# EAGLE design Muddi (EAGLE 8.0.0)
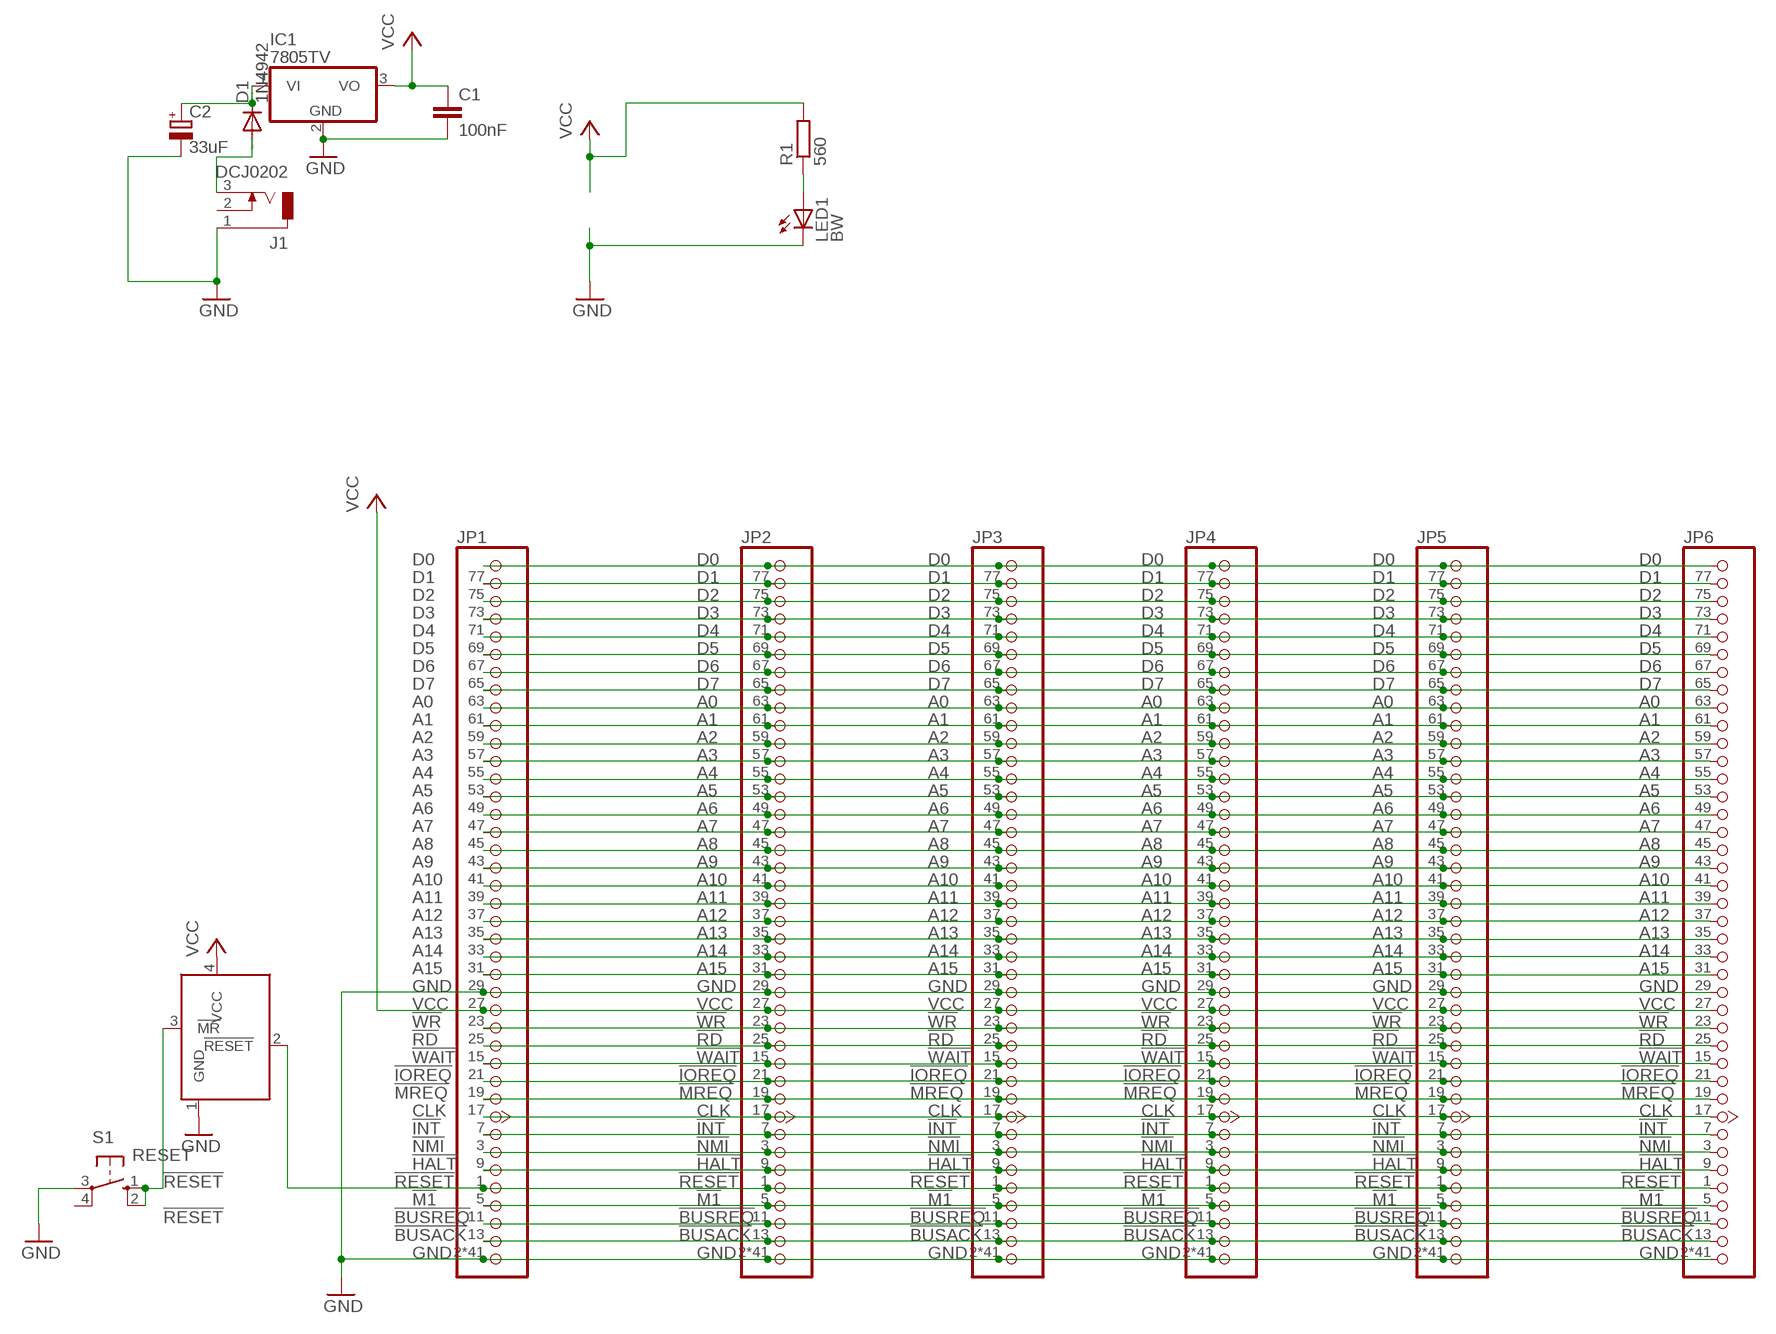
[diagram p0: schematic, sheet 1]

## Parts
C1  100nF  C2.5/2  [C2.5-2]
C2  33uF  CPOL-EUE2.5-7  [E2,5-7]
D1  1N4942  [DO41-10]
IC1  7805TV  [TO220V]
J1  DCJ0202  [DCJ0202]
JP1  JEANNECTOR_57102-F08-25  [57102-F08-25]
JP2  JEANNECTOR_57102-F08-25  [57102-F08-25]
JP3  JEANNECTOR_57102-F08-25  [57102-F08-25]
JP4  JEANNECTOR_57102-F08-25  [57102-F08-25]
JP5  JEANNECTOR_57102-F08-25  [57102-F08-25]
JP6  JEANNECTOR_57102-F08-25  [57102-F08-25]
LED1  BW  LED5MM  [LED5MM]
MAX811  MAX811  [SOT143]
R1  560  R-EU_0207/2V  [0207/2V]
S1  RESET  10-XX  [B3F-10XX]

## Nets
!BUSACK: JP1.13(!BUSACK) JP2.13(!BUSACK) JP3.13(!BUSACK) JP4.13(!BUSACK) JP5.13(!BUSACK) JP6.13(!BUSACK)
!BUSREQ: JP1.11(!BUSRQ) JP2.11(!BUSRQ) JP3.11(!BUSRQ) JP4.11(!BUSRQ) JP5.11(!BUSRQ) JP6.11(!BUSRQ)
!HALT: JP1.9(!HALT) JP2.9(!HALT) JP3.9(!HALT) JP4.9(!HALT) JP5.9(!HALT) JP6.9(!HALT)
!INT: JP1.7(!INT) JP2.7(!INT) JP3.7(!INT) JP4.7(!INT) JP5.7(!INT) JP6.7(!INT)
!IOREQ: JP1.21(!IOREQ) JP2.21(!IOREQ) JP3.21(!IOREQ) JP4.21(!IOREQ) JP5.21(!IOREQ) JP6.21(!IOREQ)
!M1: JP1.5(!M1) JP2.5(!M1) JP3.5(!M1) JP4.5(!M1) JP5.5(!M1) JP6.5(!M1)
!MREQ: JP1.19(!MREQ) JP2.19(!MREQ) JP3.19(!MREQ) JP4.19(!MREQ) JP5.19(!MREQ) JP6.19(!MREQ)
!NMI: JP1.3(!NMI) JP2.3(!NMI) JP3.3(!NMI) JP4.3(!NMI) JP5.3(!NMI) JP6.3(!NMI)
!RD: JP1.25(!RD) JP2.25(!RD) JP3.25(!RD) JP4.25(!RD) JP5.25(!RD) JP6.25(!RD)
!RESE: JP1.1(!RESET) JP2.1(!RESET) JP3.1(!RESET) JP4.1(!RESET) JP5.1(!RESET) JP6.1(!RESET) MAX811.2(!RESET)
!WAIT: JP1.15(!WAIT) JP2.15(!WAIT) JP3.15(!WAIT) JP4.15(!WAIT) JP5.15(!WAIT) JP6.15(!WAIT)
!WR: JP1.23(!WR) JP2.23(!WR) JP3.23(!WR) JP4.23(!WR) JP5.23(!WR) JP6.23(!WR)
A0: JP1.63(A0) JP2.63(A0) JP3.63(A0) JP4.63(A0) JP5.63(A0) JP6.63(A0)
A15: JP1.31(A15) JP2.31(A15) JP3.31(A15) JP4.31(A15) JP5.31(A15) JP6.31(A15)
CLK: JP1.17(CLK) JP2.17(CLK) JP3.17(CLK) JP4.17(CLK) JP5.17(CLK) JP6.17(CLK)
D0: JP1.79(D0) JP2.79(D0) JP3.79(D0) JP4.79(D0) JP5.79(D0) JP6.79(D0)
D7: JP1.65(D7) JP2.65(D7) JP3.65(D7) JP4.65(D7) JP5.65(D7) JP6.65(D7)
GND: C1.2 C2.- IC1.2(GND) J1.1 JP1.2(GND) JP1.4(GND) JP1.6(GND) JP1.8(GND) JP1.10(GND) JP1.12(GND) JP1.14(GND) JP1.16(GND) JP1.18(GND) JP1.20(GND) JP1.22(GND) JP1.24(GND) JP1.26(GND) JP1.28(GND) JP1.29(GND) JP1.30(GND) JP1.32(GND) JP1.34(GND) JP1.36(GND) JP1.38(GND) JP1.40(GND) JP1.42(GND) JP1.44(GND) JP1.46(GND) JP1.48(GND) JP1.50(GND) JP1.51(GND) JP1.52(GND) JP1.54(GND) JP1.56(GND) JP1.58(GND) JP1.60(GND) JP1.62(GND) JP1.64(GND) JP1.66(GND) JP1.68(GND) JP1.70(GND) JP1.72(GND) JP1.74(GND) JP1.76(GND) JP1.78(GND) JP1.80(GND) JP2.2(GND) JP2.4(GND) JP2.6(GND) JP2.8(GND) JP2.10(GND) JP2.12(GND) JP2.14(GND) JP2.16(GND) JP2.18(GND) JP2.20(GND) JP2.22(GND) JP2.24(GND) JP2.26(GND) JP2.28(GND) JP2.29(GND) JP2.30(GND) JP2.32(GND) JP2.34(GND) JP2.36(GND) JP2.38(GND) JP2.40(GND) JP2.42(GND) JP2.44(GND) JP2.46(GND) JP2.48(GND) JP2.50(GND) JP2.51(GND) JP2.52(GND) JP2.54(GND) JP2.56(GND) JP2.58(GND) JP2.60(GND) JP2.62(GND) JP2.64(GND) JP2.66(GND) JP2.68(GND) JP2.70(GND) JP2.72(GND) JP2.74(GND) JP2.76(GND) JP2.78(GND) JP2.80(GND) JP3.2(GND) JP3.4(GND) JP3.6(GND) JP3.8(GND) JP3.10(GND) JP3.12(GND) JP3.14(GND) JP3.16(GND) JP3.18(GND) JP3.20(GND) JP3.22(GND) JP3.24(GND) JP3.26(GND) JP3.28(GND) JP3.29(GND) JP3.30(GND) JP3.32(GND) JP3.34(GND) JP3.36(GND) JP3.38(GND) JP3.40(GND) JP3.42(GND) JP3.44(GND) JP3.46(GND) JP3.48(GND) JP3.50(GND) JP3.51(GND) JP3.52(GND) JP3.54(GND) JP3.56(GND) JP3.58(GND) JP3.60(GND) JP3.62(GND) JP3.64(GND) JP3.66(GND) JP3.68(GND) JP3.70(GND) JP3.72(GND) JP3.74(GND) JP3.76(GND) JP3.78(GND) JP3.80(GND) JP4.2(GND) JP4.4(GND) JP4.6(GND) JP4.8(GND) JP4.10(GND) JP4.12(GND) JP4.14(GND) JP4.16(GND) JP4.18(GND) JP4.20(GND) JP4.22(GND) JP4.24(GND) JP4.26(GND) JP4.28(GND) JP4.29(GND) JP4.30(GND) JP4.32(GND) JP4.34(GND) JP4.36(GND) JP4.38(GND) JP4.40(GND) JP4.42(GND) JP4.44(GND) JP4.46(GND) JP4.48(GND) JP4.50(GND) JP4.51(GND) JP4.52(GND) JP4.54(GND) JP4.56(GND) JP4.58(GND) JP4.60(GND) JP4.62(GND) JP4.64(GND) JP4.66(GND) JP4.68(GND) JP4.70(GND) JP4.72(GND) JP4.74(GND) JP4.76(GND) JP4.78(GND) JP4.80(GND) JP5.2(GND) JP5.4(GND) JP5.6(GND) JP5.8(GND) JP5.10(GND) JP5.12(GND) JP5.14(GND) JP5.16(GND) JP5.18(GND) JP5.20(GND) JP5.22(GND) JP5.24(GND) JP5.26(GND) JP5.28(GND) JP5.29(GND) JP5.30(GND) JP5.32(GND) JP5.34(GND) JP5.36(GND) JP5.38(GND) JP5.40(GND) JP5.42(GND) JP5.44(GND) JP5.46(GND) JP5.48(GND) JP5.50(GND) JP5.51(GND) JP5.52(GND) JP5.54(GND) JP5.56(GND) JP5.58(GND) JP5.60(GND) JP5.62(GND) JP5.64(GND) JP5.66(GND) JP5.68(GND) JP5.70(GND) JP5.72(GND) JP5.74(GND) JP5.76(GND) JP5.78(GND) JP5.80(GND) JP6.2(GND) JP6.4(GND) JP6.6(GND) JP6.8(GND) JP6.10(GND) JP6.12(GND) JP6.14(GND) JP6.16(GND) JP6.18(GND) JP6.20(GND) JP6.22(GND) JP6.24(GND) JP6.26(GND) JP6.28(GND) JP6.29(GND) JP6.30(GND) JP6.32(GND) JP6.34(GND) JP6.36(GND) JP6.38(GND) JP6.40(GND) JP6.42(GND) JP6.44(GND) JP6.46(GND) JP6.48(GND) JP6.50(GND) JP6.51(GND) JP6.52(GND) JP6.54(GND) JP6.56(GND) JP6.58(GND) JP6.60(GND) JP6.62(GND) JP6.64(GND) JP6.66(GND) JP6.68(GND) JP6.70(GND) JP6.72(GND) JP6.74(GND) JP6.76(GND) JP6.78(GND) JP6.80(GND) LED1.K(C) MAX811.1(GND) S1.3(P)
N$1: D1.A J1.3
N$2: JP1.77(D1) JP2.77(D1) JP3.77(D1) JP4.77(D1) JP5.77(D1) JP6.77(D1)
N$3: JP1.75(D2) JP2.75(D2) JP3.75(D2) JP4.75(D2) JP5.75(D2) JP6.75(D2)
N$4: JP1.73(D3) JP2.73(D3) JP3.73(D3) JP4.73(D3) JP5.73(D3) JP6.73(D3)
N$5: JP1.71(D4) JP2.71(D4) JP3.71(D4) JP4.71(D4) JP5.71(D4) JP6.71(D4)
N$6: JP1.69(D5) JP2.69(D5) JP3.69(D5) JP4.69(D5) JP5.69(D5) JP6.69(D5)
N$7: JP1.67(D6) JP2.67(D6) JP3.67(D6) JP4.67(D6) JP5.67(D6) JP6.67(D6)
N$10: JP1.61(A1) JP2.61(A1) JP3.61(A1) JP4.61(A1) JP5.61(A1) JP6.61(A1)
N$11: JP1.59(A2) JP2.59(A2) JP3.59(A2) JP4.59(A2) JP5.59(A2) JP6.59(A2)
N$12: JP1.57(A3) JP2.57(A3) JP3.57(A3) JP4.57(A3) JP5.57(A3) JP6.57(A3)
N$13: JP1.55(A4) JP2.55(A4) JP3.55(A4) JP4.55(A4) JP5.55(A4) JP6.55(A4)
N$14: JP1.53(A5) JP2.53(A5) JP3.53(A5) JP4.53(A5) JP5.53(A5) JP6.53(A5)
N$15: JP1.49(A6) JP2.49(A6) JP3.49(A6) JP4.49(A6) JP5.49(A6) JP6.49(A6)
N$16: JP1.47(A7) JP2.47(A7) JP3.47(A7) JP4.47(A7) JP5.47(A7) JP6.47(A7)
N$17: JP1.45(A8) JP2.45(A8) JP3.45(A8) JP4.45(A8) JP5.45(A8) JP6.45(A8)
N$18: JP1.43(A9) JP2.43(A9) JP3.43(A9) JP4.43(A9) JP5.43(A9) JP6.43(A9)
N$19: JP1.41(A10) JP2.41(A10) JP3.41(A10) JP4.41(A10) JP5.41(A10) JP6.41(A10)
N$20: JP1.39(A11) JP2.39(A11) JP3.39(A11) JP4.39(A11) JP5.39(A11) JP6.39(A11)
N$21: JP1.37(A12) JP2.37(A12) JP3.37(A12) JP4.37(A12) JP5.37(A12) JP6.37(A12)
N$22: JP1.35(A13) JP2.35(A13) JP3.35(A13) JP4.35(A13) JP5.35(A13) JP6.35(A13)
N$23: JP1.33(A14) JP2.33(A14) JP3.33(A14) JP4.33(A14) JP5.33(A14) JP6.33(A14)
N$25: LED1.A R1.1
N$26: C2.+ D1.C IC1.1(VI)
N$27: MAX811.3(!MR) S1.1(S) S1.2(S1)
VCC: C1.1 IC1.3(VO) JP1.27(VCC) JP2.27(VCC) JP3.27(VCC) JP4.27(VCC) JP5.27(VCC) JP6.27(VCC) MAX811.4(VCC) R1.2
Unconnected: J1.2 S1.4(P1)

## Library data of the parts
C1 = capacitor-wima:C: CAPACITOR naming: grid - package width
C2 = rcl:CPOL-EU: POLARIZED CAPACITOR, European symbol
D1 = diode:1N4942: DIODE 1.0 A, 200 V, 150 ns; MF: ON SEMICONDUCTOR; MPN: 1N4935G; OC_FARNELL: 1126305
IC1 = linear:78*: Positive VOLTAGE REGULATOR Source: http://cache.national.com/ds/LM/LM78L05.pdf http://www.fairchildsemi.com/ds/LM/LM7805.pdf
J1 = con-jack:DCJ0202: DC POWER JACK Source: DCJ0202.pdf; OC_FARNELL: unknown; OC_NEWARK: unknown
JP1-JP6 = jean:JEANNECTOR: PIN HEADER
LED1 = led:LED: LED OSRAM: - CHIPLED LG R971, LG N971, LY N971, LG Q971, LY Q971, LO R971, LY R971 LH N974, LH R974 LS Q976, LO Q976, LY Q976 LO Q996 - Hyper CHIPLED LW Q18S LB Q993, LB Q99A, LB R99A - SideLED LS A670, LO A670, LY A670, LG A670, LP A670 LB A673, LV A673, LT A673, LW A673 LH A674 LY A675 LS A676, LA A676, LO A676, LY A676, LW A676 LS A679, LY A679, LG A679 - Hyper Micro SIDELED® LS Y876, LA Y876, LO Y876, LY Y876 LT Y87S - SmartLED LW L88C, LW L88S LB L89C, LB L89S, LG L890 LS L89K, LO L89K, LY L89K LS L896, LA L896, LO L896, LY L896 - TOPLED LS T670, LO T670, LY T670, LG T670, LP T670 LSG T670, LSP T670, LSY T670, LOP T670, LYG T670 LG T671, LOG T671, LSG T671 LB T673, LV T673, LT T673, LW T673 LH T674 LS T676, LA T676, LO T676, LY T676, LB T676, LH T676, LSB T676, LW T676 LB T67C, LV T67C, LT T67C, LS T67K, LO T67K, LY T67K, LW E67C LS E67B, LA E67B, LO E67B, LY E67B, LB E67C, LV E67C, LT E67C LW T67C LS T679, LY T679, LG T679 LS T770, LO T770, LY T770, LG T770, LP T770 LB T773, LV T773, LT T773, LW T773 LH T774 LS E675, LA E675, LY E675, LS T675 LS T776, LA T776, LO T776, LY T776, LB T776 LHGB T686 LT T68C, LB T68C - Hyper Mini TOPLED® LB M676 - Mini TOPLED Santana® LG M470 LS M47K, LO M47K, LY M47K Source: http://www.osram.convergy.de LUXEON: - LUMILED® LXK2-PW12-R00, LXK2-PW12-S00, LXK2-PW14-U00, LXK2-PW14-V00 LXK2-PM12-R00, LXK2-PM12-S00, LXK2-PM14-U00 LXK2-PE12-Q00, LXK2-PE12-R00, LXK2-PE12-S00, LXK2-PE14-T00, LXK2-PE14-U00 LXK2-PB12-K00, LXK2-PB12-L00, LXK2-PB12-M00, LXK2-PB14-N00, LXK2-PB14-P00, LXK2-PB14-Q00 LXK2-PR12-L00, LXK2-PR12-M00, LXK2-PR14-Q00, LXK2-PR14-R00 LXK2-PD12-Q00, LXK2-PD12-R00, LXK2-PD12-S00 LXK2-PH12-R00, LXK2-PH12-S00 LXK2-PL12-P00, LXK2-PL12-Q00, LXK2-PL12-R00 Source: www.luxeon.com KINGBRIGHT: KA-3528ASYC Source: www.kingbright.com
MAX811 = jean:MAX811
R1 = resistor:R-EU_: RESISTOR, European symbol
S1 = switch-omron:10-XX: OMRON SWITCH; MF: OMRON ELECTRONIC COMPONENTS; MPN: B3F-1000; OC_FARNELL: 176432; OC_NEWARK: 36M3542

## Board
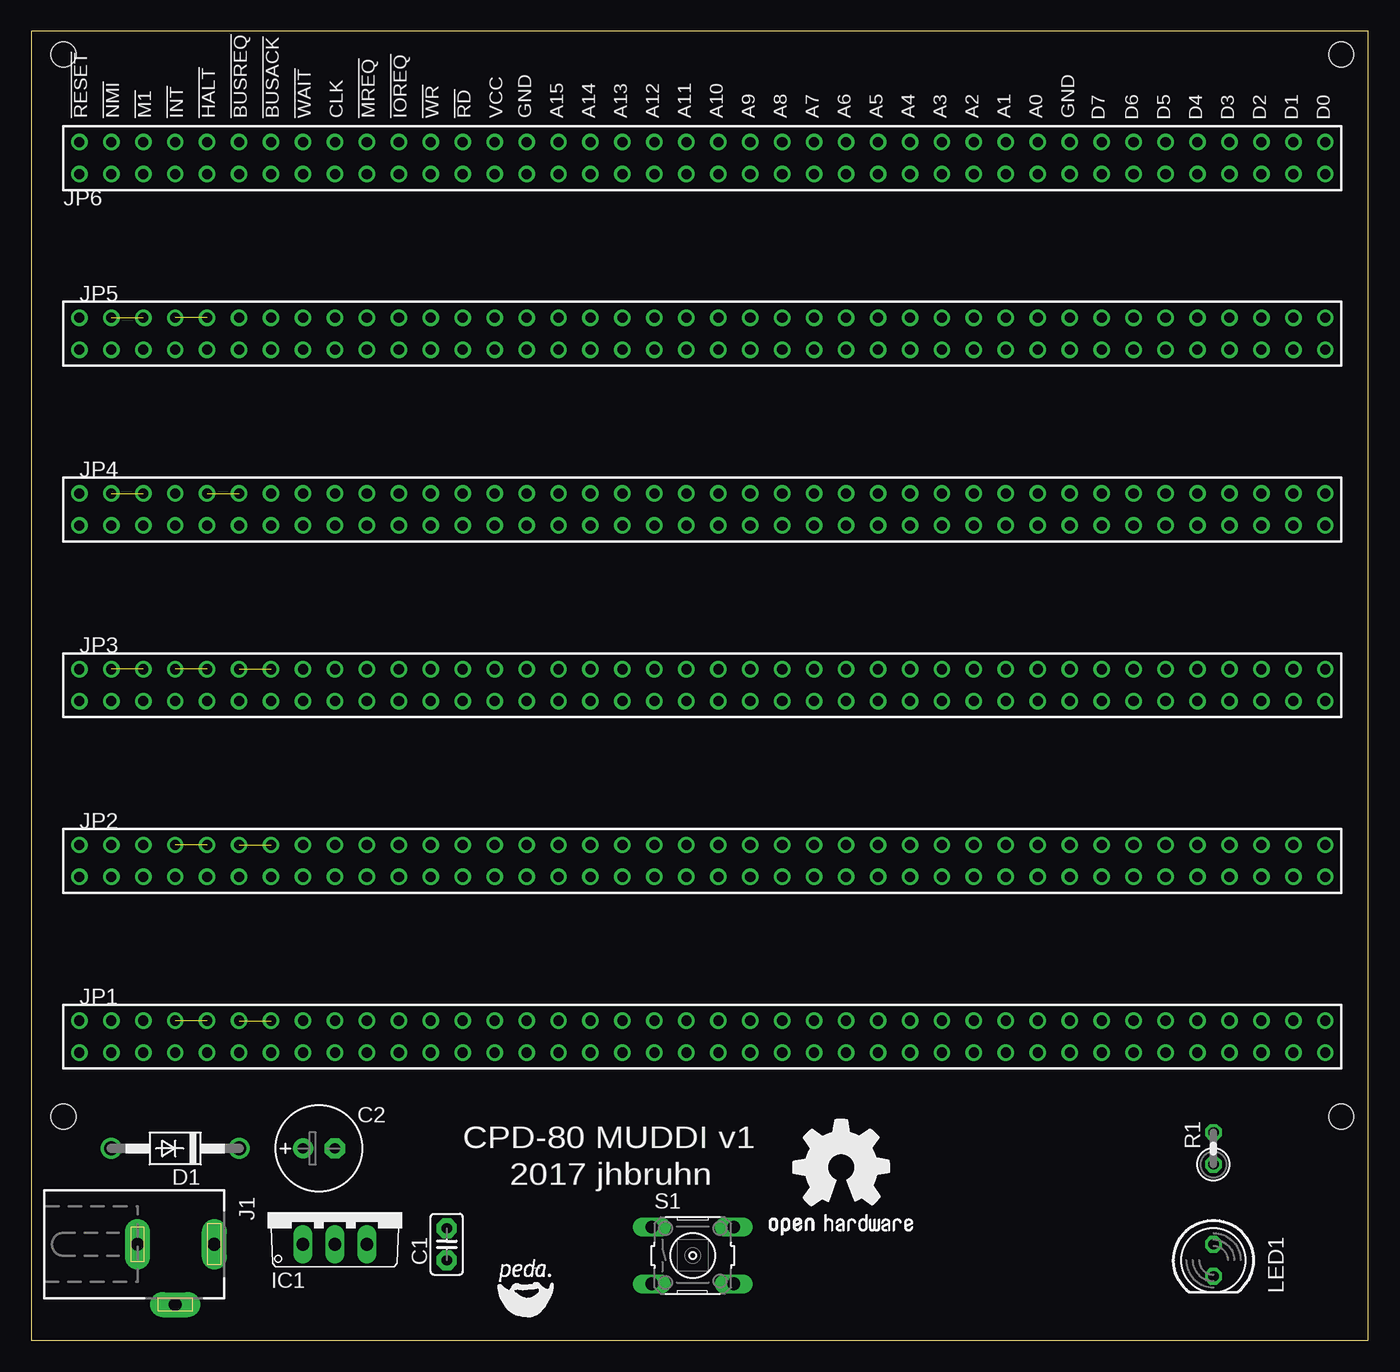
[diagram p1: board, top side]
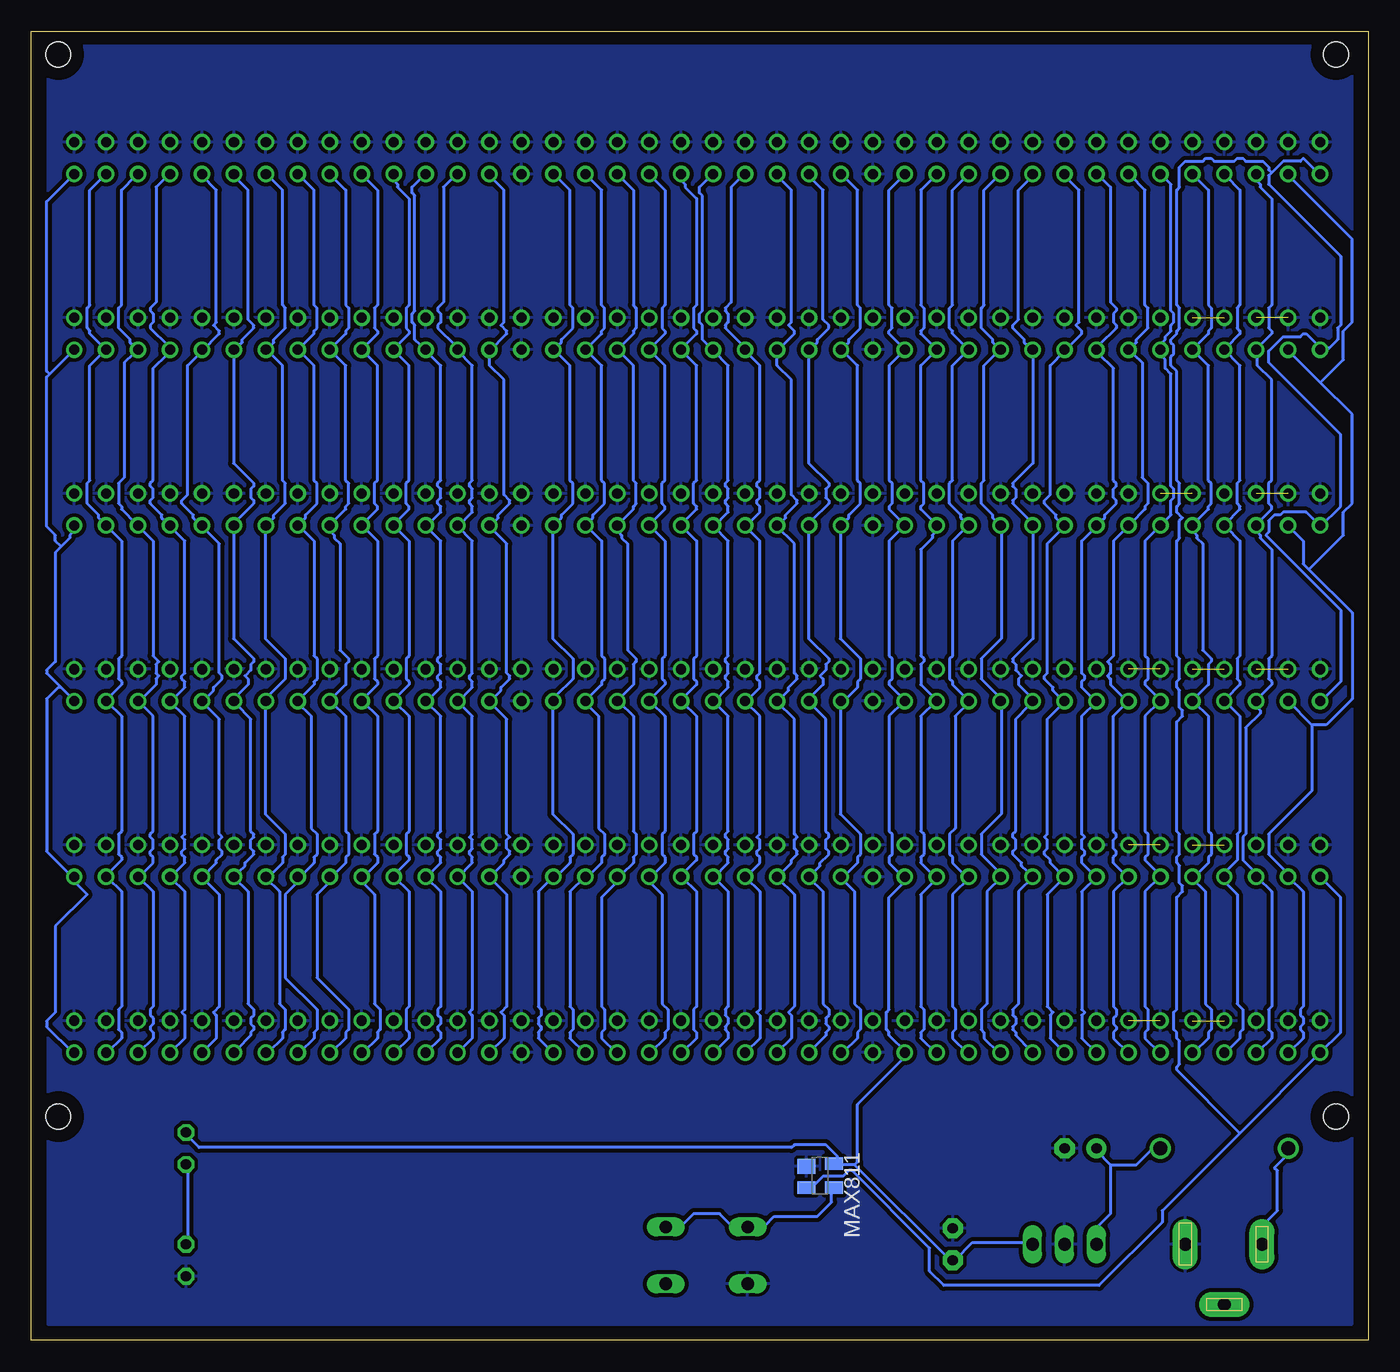
[diagram p2: board, bottom side, seen from below]

Size 106.27 x 104.05 mm. Coordinates in mm from the lower left corner, seen from the top.
Outline: 0,0 106.27,0 106.27,104.05 0,104.05 0,0
Copper layers (1*16): Top 0.035mm / dielectric 1.5mm / Bottom 0.035mm
Design rules "default": minimum track width 10mil, minimum drill 24mil, track to track 8mil, track to pad 8mil, pad to pad 8mil, via to via 8mil, smd to smd 8mil, copper to edge 40mil, drill to drill 8mil, minimum pad ring 10mil, minimum via ring 8mil, stop-mask expansion 4mil, vias tented up to drill 0mil, thermal gap 10mil
Holes 2 mm at 2.54,17.78 104.14,17.78 2.54,102.23 104.14,102.23

### Footprints (pad centres in the part's own frame; a part is rotated, then mirrored left to right if it is on the bottom)
C2.5-2 = drill 0.813 pad 1.6 octagon: 1 -1.27,0; 2 1.27,0
E2,5-7 = drill 0.813 pad 1.6: + -1.27,0 | drill 0.813 pad 1.6 octagon: - 1.27,0
DO41-10 = drill 1.118: A 5.08,0; C -5.08,0
TO220V = drill 1.016 long: 1 -2.54,-2.54; 2 0,-2.54; 3 2.54,-2.54
DCJ0202 = drill 1 pad 2 long: 1 0,3.1; 2 4.8,0; 3 0,-3
57102-F08-25 = drill 0.8 pad 1.143: 1 -8.89,-1.27; 2 -8.89,1.27; 3 -6.35,-1.27; 4 -6.35,1.27; 5 -3.81,-1.27; 6 -3.81,1.27; 7 -1.27,-1.27; 8 -1.27,1.27; 9 1.27,-1.27; 10 1.27,1.27; 11 3.81,-1.27; 12 3.81,1.27; 13 6.35,-1.27; 14 6.35,1.27; 15 8.89,-1.27; 16 8.89,1.27; 17 11.43,-1.27; 18 11.43,1.27; 19 13.97,-1.27; 20 13.97,1.27; 21 16.51,-1.27; 22 16.51,1.27; 23 19.05,-1.27; 24 19.05,1.27; 25 21.59,-1.27; 26 21.59,1.27; 27 24.13,-1.27; 28 24.13,1.27; 29 26.67,-1.27; 30 26.67,1.27; 31 29.21,-1.27; 32 29.21,1.27; 33 31.75,-1.27; 34 31.75,1.27; 35 34.29,-1.27; 36 34.29,1.27; 37 36.83,-1.27; 38 36.83,1.27; 39 39.37,-1.27; 40 39.37,1.27; 41 41.91,-1.27; 42 41.91,1.27; 43 44.45,-1.27; 44 44.45,1.27; 45 46.99,-1.27; 46 46.99,1.27; 47 49.53,-1.27; 48 49.53,1.27; 49 52.07,-1.27; 50 52.07,1.27; 51 54.61,-1.27; 52 54.61,1.27; 53 57.15,-1.27; 54 57.15,1.27; 55 59.69,-1.27; 56 59.69,1.27; 57 62.23,-1.27; 58 62.23,1.27; 59 64.77,-1.27; 60 64.77,1.27; 61 67.31,-1.27; 62 67.31,1.27; 63 69.85,-1.27; 64 69.85,1.27; 65 72.39,-1.27; 66 72.39,1.27; 67 74.93,-1.27; 68 74.93,1.27; 69 77.47,-1.27; 70 77.47,1.27; 71 80.01,-1.27; 72 80.01,1.27; 73 82.55,-1.27; 74 82.55,1.27; 75 85.09,-1.27; 76 85.09,1.27; 77 87.63,-1.27; 78 87.63,1.27; 79 90.17,-1.27; 80 90.17,1.27
LED5MM = drill 0.813 octagon: A -1.27,0; K 1.27,0
SOT143 = smd 1.2 x 1.44: 1 -0.75,-1.1 | smd 1 x 1.44: 2 0.95,-1.1; 3 0.95,1.1; 4 -0.95,1.1
0207/2V = drill 0.813 octagon: 1 -1.27,0; 2 1.27,0
B3F-10XX = drill 1.016 long: 1 -3.251,2.261; 2 3.251,2.261; 3 -3.251,-2.261; 4 3.251,-2.261

### Placement (x,y rotation side)
C1  33.02,7.62 90 top
C2  22.86,15.24 0 top
D1  11.43,15.24 180 top
IC1  24.13,10.16 0 top
J1  11.43,7.62 270 top
JP1  12.7,24.13 0 top
JP2  12.7,38.1 0 top
JP3  12.7,52.07 0 top
JP4  12.7,66.04 0 top
JP5  12.7,80.01 0 top
JP6  12.7,93.98 0 top
LED1  93.98,6.35 270 top
MAX811  43.56,13.08 270 bottom
R1  93.98,15.24 90 top
S1  52.58,6.73 0 top
U$1  [OSHW1]  58.01,6.6 0 top

### Tracks (layer width: path | path; a pad name or v marks a point on that pad's centre or on a via)
!BUSACK
  Bottom 0.254: 19.1,36.8 20.24,35.66 20.24,26.52 20.02,26.29 20.02,25.83 20.24,25.6 20.24,25.15 20.02,24.92 20.02,24.69 20.24,24.46 20.24,24 19.1,22.86 JP1.13 | 19.1,36.8 20.24,37.95 20.24,38.41 20.02,38.63 20.02,38.86 20.24,39.09 20.24,39.78 20.02,40.01 20.02,40.23 20.24,40.46 20.24,49.61 JP3.13 19.1,50.98 19.33,50.98 20.47,52.12 20.47,52.58 20.7,52.81 20.47,53.03 20.47,53.72 20.7,53.95 20.24,54.41 20.24,63.55 19.1,64.69 JP4.13 18.87,64.92 17.73,66.06 17.73,66.29 17.5,66.52 17.5,68.12 17.96,68.58 17.96,77.72 18.64,78.41 | 19.1,36.8 JP2.13 | 18.64,78.41 18.87,78.64 JP5.13 18.64,78.41 | 18.64,78.41 18.64,79.1 18.41,79.32 18.41,79.55 17.5,80.47 17.5,82.07 17.73,82.3 17.73,91.44 18.87,92.58 JP6.13
!BUSREQ
  Bottom 0.254: JP1.11 16.59,22.86 17.73,24 17.73,24.46 17.5,24.69 17.5,26.29 17.73,26.52 17.73,35.66 16.59,36.8 JP2.11 16.59,37.03 17.73,38.18 17.73,38.41 17.5,38.63 17.5,40.23 17.73,40.46 17.73,49.61 16.59,50.75 JP3.11 16.59,50.98 17.73,52.12 17.73,52.35 17.5,52.58 17.5,54.18 17.73,54.41 17.73,63.55 JP4.11 16.59,64.92 16.36,65.15 16.13,65.15 15.67,65.61 15.67,66.75 15.44,66.98 15.44,67.67 15.67,67.89 15.67,76.81 16.13,77.27 16.13,77.95 16.36,78.18 16.36,78.64 JP5.11 16.36,78.87 16.36,79.32 16.13,79.55 16.13,79.78 15.67,80.24 15.67,80.7 15.44,80.92 15.44,81.61 15.67,81.84 15.67,91.9 16.36,92.58 JP6.11
!HALT
  Bottom 0.254: JP6.9 12.7,91.44 12.7,82.3 12.47,82.07 12.47,80.47 12.7,80.24 12.7,80.01 JP5.9 13.84,78.64 12.7,77.5 12.7,68.35 12.47,68.12 12.47,66.52 12.7,66.29 12.7,66.06 13.84,64.92 JP4.9 13.84,64.69 13.84,64.24 13.61,64.01 13.61,63.78 13.16,63.32 13.16,54.86 12.47,54.18 12.47,53.95 12.7,53.72 12.7,52.12 13.84,50.98 JP3.9 13.84,50.75 12.7,49.61 12.7,40.46 12.47,40.23 12.47,38.63 12.7,38.41 12.7,37.95 13.61,37.03 13.84,37.03 JP2.9 14.07,36.8 12.93,35.66 12.93,26.75 12.47,26.29 12.47,24.69 12.7,24.46 12.7,24 13.84,22.86 JP1.9
!INT
  Bottom 0.254: JP6.7 11.33,92.58 10.18,91.44 10.18,82.3 10.41,82.07 10.41,80.47 10.18,80.24 10.18,80.01 11.33,78.87 JP5.7 10.18,77.5 10.18,68.35 10.41,68.12 10.41,66.52 10.18,66.29 10.18,66.06 11.33,64.92 JP4.7 11.33,64.69 10.18,63.55 10.18,54.41 10.41,54.18 10.41,52.58 10.18,52.35 10.18,52.12 11.33,50.98 JP3.7 11.33,50.75 10.18,49.61 10.18,40.46 10.41,40.23 10.41,38.18 11.33,37.26 11.33,37.03 JP2.7 11.33,36.8 11.33,36.35 10.41,35.43 10.41,26.75 9.96,26.29 9.96,24.69 10.18,24.46 10.18,24 11.33,22.86 JP1.7
!IOREQ
  Bottom 0.254: JP1.21 29.39,22.86 30.53,24 30.53,24.46 30.76,24.69 30.76,26.29 30.3,26.75 30.3,35.66 29.16,36.8 JP2.21 29.39,37.03 29.39,37.26 30.76,38.63 30.76,40.23 29.16,41.83 29.16,50.75 JP3.21 29.39,50.98 29.39,51.21 30.76,52.58 30.76,54.18 29.16,55.78 29.16,64.69 JP4.21 29.16,64.92 29.39,65.15 29.62,65.15 29.84,65.38 29.84,65.61 30.76,66.52 30.76,68.12 30.53,68.35 30.53,77.5 29.62,78.41 | 29.62,78.41 29.39,78.64 JP5.21 29.62,78.41 | 29.62,78.41 29.62,79.1 29.84,79.32 29.84,79.55 30.76,80.47 30.76,82.07 30.53,82.3 30.53,91.44 29.39,92.58 JP6.21
!M1
  Bottom 0.254: JP6.5 8.81,92.58 8.81,92.13 8.59,91.9 8.59,91.67 7.67,90.75 7.67,82.3 7.9,82.07 7.9,80.47 7.67,80.24 7.67,80.01 8.81,78.87 JP5.5 8.81,78.64 8.81,77.5 7.67,76.35 7.67,68.35 7.9,68.12 7.9,66.52 7.67,66.29 7.67,66.06 8.81,64.92 JP4.5 8.81,64.69 8.81,64.24 8.59,64.01 8.59,63.78 7.67,62.87 7.67,54.41 7.9,54.18 7.9,52.58 7.67,52.35 7.67,52.12 8.81,50.98 JP3.5 8.81,50.75 8.81,50.29 8.59,50.06 8.59,49.84 9.73,48.69 9.73,40.23 9.96,40.01 9.96,38.18 9.04,37.26 9.04,37.03 JP2.5 8.81,36.8 7.67,35.66 7.67,26.52 7.9,26.29 7.9,24.69 7.67,24.46 7.67,24 8.81,22.86 JP1.5
!MREQ
  Bottom 0.254: JP1.19 26.87,22.86 26.87,23.09 28.02,24.23 28.02,24.46 28.25,24.69 28.25,24.92 28.02,25.15 28.02,25.6 28.25,25.83 28.25,26.29 27.79,26.75 27.79,35.66 26.64,36.8 JP2.19 26.64,37.03 26.87,37.26 27.1,37.26 27.56,37.72 27.56,37.95 28.25,38.63 28.25,38.86 28.02,39.09 28.02,39.78 28.25,40.01 28.25,40.23 28.02,40.46 28.02,49.38 26.87,50.52 26.87,50.75 JP3.19 26.87,50.98 26.87,51.21 27.79,52.12 27.79,52.58 27.56,52.81 28.02,53.26 28.02,53.72 28.25,53.95 28.25,54.18 26.64,55.78 26.64,64.69 JP4.19 26.87,64.92 26.87,65.15 28.25,66.52 28.25,66.75 28.02,66.98 28.02,67.67 28.25,67.89 28.25,68.12 26.64,69.72 26.64,78.64 JP5.19 26.64,78.87 26.87,79.1 27.1,79.1 27.33,79.32 27.33,79.55 28.25,80.47 28.25,80.7 27.79,81.15 27.79,91.44 26.87,92.35 26.87,92.58 JP6.19
!NMI
  Bottom 0.254: JP1.3 6.3,22.86 5.16,24 5.16,24.46 5.38,24.69 5.38,24.92 5.16,25.15 5.16,25.6 5.38,25.83 5.38,26.29 5.16,26.52 5.16,35.66 6.3,36.8 JP2.3 6.53,37.03 6.53,37.26 7.9,38.63 7.9,40.23 4.47,43.66 4.47,48.92 | 4.47,48.92 JP3.3 | 4.47,48.92 3.33,48.92 1.27,50.98 1.27,57.84 4.7,61.27 | 4.7,61.27 5.16,61.72 5.16,63.55 6.3,64.69 JP4.3 | 3.79,76.12 1.27,73.61 1.27,66.52 1.96,65.84 1.96,64.01 4.7,61.27 | 3.79,76.12 6.3,78.64 JP5.3 | 3.79,76.12 1.96,77.95 1.96,80.24 1.27,80.92 1.27,87.55 6.3,92.58 JP6.3
!RD
  Bottom 0.254: JP6.25 35.56,91.44 35.56,82.3 35.33,82.07 35.33,80.47 35.56,80.24 35.56,80.01 JP5.25 34.42,78.64 35.56,77.5 35.56,68.35 35.33,68.12 35.33,66.52 35.56,66.29 35.56,66.06 34.42,64.92 JP4.25 34.42,64.69 34.42,64.24 34.65,64.01 34.65,63.78 35.56,62.87 35.56,54.41 35.33,54.18 35.33,53.95 35.56,53.72 35.56,52.12 34.42,50.98 JP3.25 34.42,50.75 35.56,49.61 35.56,40.46 35.33,40.23 35.33,38.63 35.56,38.41 35.56,37.95 34.65,37.03 34.42,37.03 JP2.25 34.19,36.8 35.56,35.43 35.56,26.52 35.33,26.29 35.33,24.69 35.56,24.46 35.56,24 34.42,22.86 JP1.25
!RESE
  Bottom 0.254: 7.67,92.81 6.76,93.73 5.38,93.73 5.16,93.95 4.24,93.04 4.01,93.04 3.79,92.81 JP6.1 | 7.67,92.81 7.9,92.58 7.9,91.9 2.18,86.18 2.18,80.7 2.41,80.47 2.41,79.55 3.1,78.87 3.79,78.87 JP5.1 4.01,78.87 4.01,79.1 4.93,80.01 5.16,80.01 5.38,79.78 6.76,79.78 7.9,78.64 7.9,77.72 2.18,72.01 2.18,66.29 3.79,64.69 JP4.1 3.79,64.92 4.01,65.15 4.24,65.15 4.93,65.84 6.76,65.84 6.98,65.61 7.44,65.61 7.9,65.15 7.9,64.24 8.13,64.01 2.18,58.06 2.18,52.35 3.56,50.98 3.79,50.98 JP3.1 | 3.79,22.86 10.18,16.46 | 10.18,16.46 16.36,10.29 16.36,9.37 21.39,4.34 33.73,4.34 34.87,5.49 34.87,7.32 41.05,13.49 41.28,13.49 41.73,13.03 43.33,13.03 44.02,12.34 44.48,12.34 MAX811.2 | JP2.1 2.18,35.2 2.18,24.46 3.79,22.86 | 3.79,22.86 JP1.1 | 7.67,92.81 7.9,93.04 7.9,93.27 8.36,93.73 9.73,93.73 9.96,93.95 10.41,93.95 10.64,93.73 12.24,93.73 12.47,93.95 12.93,93.95 13.16,93.73 14.53,93.73 14.99,93.27 14.99,91.67 15.21,91.44 15.21,82.3 14.99,82.07 14.99,80.47 15.21,80.24 15.21,80.01 15.67,79.55 15.67,79.32 15.44,79.1 15.44,78.41 15.67,78.18 15.67,77.5 15.21,77.04 15.21,68.35 14.99,68.12 14.99,66.52 15.21,66.29 15.21,65.84 14.76,65.38 14.99,65.15 14.99,63.78 15.21,63.55 15.21,54.41 14.99,54.18 14.99,52.58 15.21,52.35 15.21,51.89 14.99,51.66 14.99,50.29 14.76,50.06 14.76,49.61 15.21,49.15 15.21,40.46 14.99,40.23 14.99,38.63 15.21,38.41 15.21,37.95 14.99,37.72 14.99,36.35 14.76,36.12 14.76,35.66 15.21,35.2 15.21,26.29 15.44,26.06 15.44,24.69 15.21,24.46 15.21,24 14.99,23.77 14.99,21.95 15.21,21.72 15.21,21.49 10.18,16.46
!WAIT
  Bottom 0.254: JP6.15 21.39,92.81 21.16,92.58 21.16,92.35 20.47,91.67 20.47,82.53 20.02,82.07 20.02,81.84 20.24,81.61 20.24,80.92 20.02,80.7 20.02,80.47 21.39,79.1 21.39,78.87 JP5.15 21.39,78.64 21.39,78.41 20.24,77.27 20.24,68.35 20.02,68.12 20.02,67.89 20.24,67.67 20.24,66.98 20.02,66.75 20.02,66.52 20.93,65.61 20.93,65.38 21.16,65.15 21.39,65.15 21.61,64.92 JP4.15 21.61,64.69 22.76,63.55 22.76,53.03 22.53,52.81 22.53,52.58 22.76,52.35 22.76,51.89 21.61,50.75 | 21.61,36.8 22.76,35.66 22.76,26.29 22.53,26.06 22.76,25.83 22.76,24 21.61,22.86 JP1.15 | 21.61,50.75 22.76,49.61 22.76,40.23 22.53,40.01 22.76,39.78 22.76,39.09 22.53,38.86 22.53,38.63 22.76,38.41 22.76,37.95 21.61,36.8 | 21.61,36.8 JP2.15 | 21.61,50.75 JP3.15
!WR
  Bottom 0.254: JP1.23 31.9,22.86 33.05,24 33.05,24.46 32.82,24.69 32.82,26.29 33.05,26.52 33.05,35.43 31.67,36.8 JP2.23 31.9,37.03 32.13,37.03 33.05,37.95 33.05,38.41 33.27,38.63 33.27,40.23 32.82,40.69 32.82,49.61 31.67,50.75 JP3.23 31.9,50.98 33.05,52.12 33.05,52.35 33.27,52.58 33.27,54.18 33.05,54.41 33.05,63.55 32.13,64.47 | 32.13,64.47 31.9,64.69 JP4.23 32.13,64.47 | 32.13,64.47 32.13,65.15 32.36,65.38 32.36,65.61 33.27,66.52 33.27,68.12 33.05,68.35 33.05,77.5 31.9,78.64 JP5.23 31.9,78.87 33.05,80.01 33.05,80.24 33.27,80.47 33.27,82.07 33.05,82.3 33.05,91.44 31.9,92.58 JP6.23
A0
  Bottom 0.254: JP6.63 81.28,91.44 81.28,82.3 81.05,82.07 81.05,80.47 81.28,80.24 81.28,80.01 JP5.63 82.42,78.64 81.28,77.5 81.28,68.35 81.05,68.12 81.05,66.52 81.28,66.29 81.28,66.06 82.42,64.92 JP4.63 82.42,64.69 82.42,64.24 82.19,64.01 82.19,63.78 81.74,63.32 81.74,54.86 81.05,54.18 81.05,53.95 81.28,53.72 81.28,52.12 82.42,50.98 JP3.63 82.42,50.75 81.28,49.61 81.28,40.46 81.05,40.23 81.05,38.63 81.28,38.41 81.28,37.95 82.19,37.03 82.42,37.03 JP2.63 82.65,36.8 82.65,36.35 83.57,35.43 83.57,28.8 81.05,26.29 81.05,24.69 81.28,24.46 81.28,24 82.42,22.86 JP1.63
A15
  Bottom 0.254: JP1.31 41.73,22.86 40.59,24 40.59,24.46 40.36,24.69 40.36,26.29 40.82,26.75 40.82,35.66 41.96,36.8 JP2.31 41.73,37.03 41.5,37.03 40.59,37.95 40.59,38.41 40.36,38.63 40.36,40.23 41.96,41.83 41.96,50.75 JP3.31 41.73,50.98 41.5,50.98 40.59,51.89 40.59,52.35 40.36,52.58 40.36,54.18 41.96,55.78 41.96,64.69 JP4.31 41.96,64.92 41.73,65.15 41.5,65.15 41.28,65.38 41.28,65.61 40.36,66.52 40.36,68.12 40.59,68.35 40.59,77.5 41.5,78.41 | 41.5,78.41 41.73,78.64 JP5.31 41.5,78.41 | 41.5,78.41 41.5,79.1 41.28,79.32 41.28,79.55 40.36,80.47 40.36,82.07 40.59,82.3 40.59,91.44 41.73,92.58 JP6.31
CLK
  Bottom 0.254: JP1.17 25.27,24 25.27,25.83 25.04,26.06 25.5,26.52 25.5,35.43 24.13,36.8 | 24.13,50.75 25.5,49.38 25.5,40.23 25.73,40.01 25.5,39.78 25.5,39.09 25.73,38.86 25.73,38.63 25.27,38.18 25.27,37.95 24.13,36.8 | 24.13,36.8 JP2.17 | 24.13,64.69 25.5,63.32 25.5,53.03 25.73,52.81 25.73,52.58 25.04,51.89 25.04,51.66 24.13,50.75 | 24.13,50.75 JP3.17 | 24.13,78.64 25.27,77.5 25.27,67.21 25.73,66.75 25.73,66.52 24.82,65.61 24.82,65.38 24.13,64.69 | 24.13,64.69 JP4.17 | 24.13,78.64 22.76,80.01 22.76,80.24 23.22,80.7 22.99,80.92 22.99,91.44 24.13,92.58 JP6.17 | 24.13,78.64 JP5.17
D0
  Bottom 0.254: JP1.79 103,22.86 105.05,24.92 105.05,25.38 104.37,26.06 104.37,32.92 101.85,35.43 102.77,36.35 102.77,36.8 JP2.79 103,37.03 103.23,37.03 105.05,38.86 105.05,50.98 104.14,51.89 103.91,51.89 | 103.91,51.89 105.05,53.03 105.05,53.26 104.37,53.95 104.37,62.64 103.91,63.09 | 103.91,51.89 103,50.98 JP3.79 | 103.91,63.09 103.23,63.78 103.23,64.01 103,64.24 103,64.69 JP4.79 | 104.83,76.81 105.05,76.58 105.05,64.69 104.37,64.01 104.37,63.55 103.91,63.09 | 104.83,76.81 103,78.64 JP5.79 | JP6.79 105.05,90.53 105.05,77.04 104.83,76.81
D7
  Bottom 0.254: JP1.65 84.94,22.86 83.8,24 83.8,24.46 83.57,24.69 83.57,26.29 86.08,28.8 86.08,35.43 85.17,36.35 85.17,36.8 JP2.65 84.94,37.03 84.71,37.03 83.8,37.95 83.8,38.41 83.57,38.63 83.57,40.23 84.02,40.69 84.02,49.61 85.17,50.75 JP3.65 84.94,50.98 83.8,52.12 83.8,52.35 83.57,52.58 83.57,54.18 83.8,54.41 83.8,63.55 84.71,64.47 | 84.71,64.47 84.94,64.69 JP4.65 84.71,64.47 | 84.71,64.47 84.71,65.15 84.48,65.38 84.48,65.61 83.57,66.52 83.57,68.12 83.8,68.35 83.8,77.5 84.94,78.64 JP5.65 84.94,78.87 83.8,80.01 83.8,80.24 83.57,80.47 83.57,82.07 83.8,82.3 83.8,91.44 84.94,92.58 JP6.65
GND  (11 unrouted)
  pour Bottom (isolate 0.305): 1.27,103.05 104.98,103.05 104.98,1.27 1.27,1.27
N$1
  Bottom 0.254: D1.A 6.53,15.09 6.53,14.63 7.44,13.72 7.21,13.49 7.21,10.29 8.36,9.14 8.36,7.77 J1.3
N$2
  Bottom 0.254: JP1.77 100.25,22.86 99.11,24 99.11,24.46 99.34,24.69 99.34,26.29 99.11,26.52 99.11,35.66 100.25,36.8 JP2.77 100.25,37.03 99.11,38.18 99.11,38.41 99.34,38.63 99.34,40.23 99.11,40.46 99.11,49.61 100.25,50.75 JP3.77 100.25,50.98 99.11,52.12 99.11,52.35 99.34,52.58 99.34,54.18 99.11,54.41 99.11,63.55 JP4.77 100.25,64.92 100.48,65.15 100.71,65.15 100.94,65.38 100.94,65.61 101.85,66.52 101.85,68.12 101.62,68.35 101.62,77.5 100.48,78.64 JP5.77 100.48,78.87 101.62,80.01 101.62,80.24 101.85,80.47 101.85,82.07 101.62,82.3 101.62,91.44 100.48,92.58 JP6.77
N$3
  Bottom 0.254: 97.74,36.8 96.6,35.66 96.6,26.52 96.83,26.29 96.83,25.83 96.6,25.6 96.6,25.15 96.83,24.92 96.83,24.69 96.6,24.46 96.6,24 97.74,22.86 JP1.75 | 97.74,36.8 96.6,37.95 96.6,38.41 96.83,38.63 96.83,38.86 96.6,39.09 96.6,39.78 96.83,40.01 96.83,40.23 96.6,40.46 96.6,49.61 JP3.75 97.74,50.98 97.51,50.98 96.37,52.12 96.37,52.58 96.14,52.81 96.37,53.03 96.37,53.72 96.14,53.95 96.6,54.41 96.6,63.55 97.74,64.69 JP4.75 97.97,64.92 99.11,66.06 99.11,66.29 99.34,66.52 99.34,68.12 98.88,68.58 98.88,77.72 98.2,78.41 | 97.74,36.8 JP2.75 | 98.2,78.41 97.97,78.64 JP5.75 98.2,78.41 | 98.2,78.41 98.2,79.1 98.42,79.32 98.42,79.55 99.34,80.47 99.34,82.07 99.11,82.3 99.11,91.44 97.97,92.58 JP6.75
N$4
  Bottom 0.254: JP6.73 95.22,92.58 95.45,92.35 95.68,92.35 96.37,91.67 96.37,82.53 96.83,82.07 96.83,81.84 96.6,81.61 96.6,80.92 96.83,80.7 96.83,80.47 95.45,79.1 95.45,78.87 JP5.73 95.45,78.64 95.45,78.41 96.6,77.27 96.6,68.35 96.83,68.12 96.83,67.89 96.6,67.67 96.6,66.98 96.83,66.75 96.83,66.52 95.91,65.61 95.91,65.38 95.68,65.15 95.45,65.15 95.22,64.92 JP4.73 95.22,64.69 94.08,63.55 94.08,53.03 94.31,52.81 94.31,52.58 94.08,52.35 94.08,51.89 95.22,50.75 | 95.22,36.8 94.08,35.66 94.08,26.29 94.31,26.06 94.08,25.83 94.08,24 95.22,22.86 JP1.73 | 95.22,50.75 94.08,49.61 94.08,40.23 94.31,40.01 94.08,39.78 94.08,39.09 94.31,38.86 94.31,38.63 94.08,38.41 94.08,37.95 95.22,36.8 | 95.22,36.8 JP2.73 | 95.22,50.75 JP3.73
N$5
  Bottom 0.254: JP1.71 91.57,24 91.57,25.83 91.8,26.06 91.34,26.52 91.34,35.43 92.71,36.8 | 92.71,50.75 91.34,49.38 91.34,40.23 91.11,40.01 91.34,39.78 91.34,39.09 91.11,38.86 91.11,38.63 91.57,38.18 91.57,37.95 92.71,36.8 | 92.71,36.8 JP2.71 | 92.71,64.69 91.34,63.32 91.34,53.03 91.11,52.81 91.11,52.58 91.8,51.89 91.8,51.66 92.71,50.75 | 92.71,50.75 JP3.71 | 92.71,78.64 93.85,77.5 93.85,67.21 94.31,66.75 94.31,66.52 93.4,65.61 93.4,65.38 92.71,64.69 | 92.71,64.69 JP4.71 | 92.71,78.64 91.34,80.01 91.34,80.24 91.8,80.7 91.57,80.92 91.57,91.44 92.71,92.58 JP6.71 | 92.71,78.64 JP5.71
N$6
  Bottom 0.254: JP1.69 89.97,22.86 89.97,23.09 88.82,24.23 88.82,24.46 88.59,24.69 88.59,24.92 88.82,25.15 88.82,25.6 88.59,25.83 88.59,26.29 89.05,26.75 89.05,35.66 90.19,36.8 JP2.69 90.19,37.03 89.97,37.26 89.74,37.26 89.28,37.72 89.28,37.95 88.59,38.63 88.59,38.86 88.82,39.09 88.82,39.78 88.59,40.01 88.59,40.23 88.82,40.46 88.82,49.38 89.97,50.52 89.97,50.75 JP3.69 89.97,50.98 89.97,51.21 89.05,52.12 89.05,52.58 89.28,52.81 88.82,53.26 88.82,53.72 88.59,53.95 88.59,54.18 90.19,55.78 90.19,64.69 JP4.69 89.97,64.92 89.97,65.15 88.59,66.52 88.59,66.75 88.82,66.98 88.82,67.67 88.59,67.89 88.59,68.12 90.19,69.72 90.19,78.64 JP5.69 90.19,78.87 89.97,79.1 89.74,79.1 89.51,79.32 89.51,79.55 88.59,80.47 88.59,80.7 89.05,81.15 89.05,91.44 89.97,92.35 89.97,92.58 JP6.69
N$7
  Bottom 0.254: JP1.67 87.45,22.86 86.31,24 86.31,24.46 86.08,24.69 86.08,26.29 86.54,26.75 86.54,35.66 87.68,36.8 JP2.67 87.45,37.03 87.22,37.03 86.31,37.95 86.31,38.41 86.08,38.63 86.08,40.23 87.68,41.83 87.68,50.75 JP3.67 87.45,50.98 87.45,51.21 86.08,52.58 86.08,54.18 87.68,55.78 87.68,64.69 JP4.67 87.68,64.92 87.45,65.15 87.22,65.15 86.99,65.38 86.99,65.61 86.08,66.52 86.08,68.12 86.31,68.35 86.31,77.5 87.22,78.41 | 87.22,78.41 87.45,78.64 JP5.67 87.22,78.41 | 87.22,78.41 87.22,79.1 86.99,79.32 86.99,79.55 86.08,80.47 86.08,82.07 86.31,82.3 86.31,91.44 87.45,92.58 JP6.67
N$10
  Bottom 0.254: JP6.61 79.91,92.58 78.77,91.44 78.77,82.3 78.99,82.07 78.99,80.47 78.77,80.24 78.77,80.01 79.91,78.87 JP5.61 78.77,77.5 78.77,68.35 78.99,68.12 78.99,66.52 78.77,66.29 78.77,66.06 79.91,64.92 JP4.61 79.91,64.69 78.77,63.55 78.77,54.41 78.99,54.18 78.99,52.58 78.77,52.35 78.77,52.12 79.91,50.98 JP3.61 79.91,50.75 78.77,49.61 78.77,40.46 78.99,40.23 78.99,38.63 78.77,38.41 78.77,37.95 79.68,37.03 79.91,37.03 JP2.61 79.91,36.8 79.91,36.35 78.99,35.43 78.99,26.75 78.54,26.29 78.54,24.69 78.77,24.46 78.77,24 79.91,22.86 JP1.61
N$11
  Bottom 0.254: JP6.59 77.39,92.58 77.39,92.13 77.16,91.9 77.16,91.67 76.25,90.75 76.25,82.3 76.48,82.07 76.48,80.47 76.25,80.24 76.25,80.01 77.39,78.87 JP5.59 77.39,78.64 76.25,77.5 76.25,68.35 76.48,68.12 76.48,66.52 76.25,66.29 76.25,66.06 77.39,64.92 JP4.59 76.25,63.55 76.25,54.41 76.48,54.18 76.48,52.58 76.25,52.35 76.25,52.12 77.39,50.98 JP3.59 77.39,50.75 76.25,49.61 76.25,40.46 76.48,40.23 76.48,38.63 76.25,38.41 76.25,38.18 77.39,37.03 JP2.59 77.39,36.8 76.25,35.66 76.25,26.52 76.48,26.29 76.48,24.69 76.25,24.46 76.25,24 77.39,22.86 JP1.59
N$12
  Bottom 0.254: 74.88,36.8 73.74,35.66 73.74,26.52 73.96,26.29 73.96,25.83 73.74,25.6 73.74,25.15 73.96,24.92 73.96,24.69 73.74,24.46 73.74,24 74.88,22.86 JP1.57 | 74.88,50.75 73.74,49.61 73.74,40.46 73.96,40.23 73.96,40.01 73.74,39.78 73.74,39.09 73.96,38.86 73.96,38.63 73.74,38.41 73.74,37.95 74.88,36.8 | 74.88,36.8 JP2.57 | 74.88,64.69 73.74,63.55 73.74,54.41 73.96,54.18 73.96,53.95 73.74,53.72 73.74,53.03 73.96,52.81 73.96,52.58 73.74,52.35 73.74,51.89 74.88,50.75 | 74.88,50.75 JP3.57 | 74.88,64.69 73.74,65.84 73.74,66.29 73.96,66.52 73.96,66.75 73.74,66.98 73.74,67.67 73.96,67.89 73.96,68.12 73.74,68.35 73.74,77.5 74.88,78.64 JP5.57 74.88,78.87 75.11,79.1 75.34,79.1 75.79,79.55 75.79,80.7 76.02,80.92 76.02,81.61 75.79,81.84 75.79,90.98 76.02,91.21 76.02,91.67 75.11,92.58 JP6.57 | 74.88,64.69 JP4.57
N$13
  Bottom 0.254: JP6.55 72.36,92.58 72.59,92.35 72.82,92.35 73.51,91.67 73.51,82.53 73.96,82.07 73.96,81.84 73.74,81.61 73.74,80.92 73.96,80.7 73.96,80.47 72.59,79.1 72.59,78.87 JP5.55 72.36,78.64 71.22,77.5 71.22,68.35 71.45,68.12 71.45,67.89 71.22,67.67 71.22,66.98 71.45,66.75 71.45,66.52 71.22,66.29 71.22,65.84 72.36,64.69 | 72.36,36.8 71.22,35.66 71.22,26.29 71.45,26.06 71.22,25.83 71.22,24 72.36,22.86 JP1.55 | 72.36,50.75 71.22,49.61 71.22,40.23 71.45,40.01 71.22,39.78 71.22,39.09 71.45,38.86 71.45,38.63 71.22,38.41 71.22,37.95 72.36,36.8 | 72.36,36.8 JP2.55 | 72.36,64.69 71.22,63.55 71.22,53.03 71.45,52.81 71.45,52.58 71.22,52.35 71.22,51.89 72.36,50.75 | 72.36,50.75 JP3.55 | 72.36,64.69 JP4.55
N$14
  Bottom 0.254: JP1.53 68.71,24 68.71,25.83 68.94,26.06 68.48,26.52 68.48,35.43 69.85,36.8 | 69.85,50.75 68.48,49.38 68.48,40.23 68.25,40.01 68.48,39.78 68.48,39.09 68.25,38.86 68.25,38.63 68.71,38.18 68.71,37.95 69.85,36.8 | 69.85,36.8 JP2.53 | 69.85,64.69 68.48,63.32 68.48,53.03 68.25,52.81 68.25,52.58 68.94,51.89 68.94,51.66 69.85,50.75 | 69.85,50.75 JP3.53 | 69.85,78.64 69.85,77.5 68.71,76.35 68.71,67.21 68.25,66.75 68.25,66.52 69.16,65.61 69.16,65.38 69.85,64.69 | 69.85,64.69 JP4.53 | 69.85,78.64 68.48,80.01 68.48,80.24 68.94,80.7 68.71,80.92 68.71,91.44 69.85,92.58 JP6.53 | 69.85,78.64 JP5.53
N$15
  Bottom 0.254: JP1.49 64.82,22.86 65.96,24 65.96,24.46 65.73,24.69 65.73,24.92 65.96,25.15 65.96,25.6 65.73,25.83 65.73,26.29 65.96,26.52 65.96,35.66 64.82,36.8 JP2.49 64.59,37.03 64.36,37.03 63.45,37.95 63.45,38.41 63.22,38.63 63.22,40.23 64.82,41.83 64.82,50.75 JP3.49 64.59,50.98 64.59,51.21 63.22,52.58 63.22,54.18 64.82,55.78 64.82,64.69 JP4.49 64.82,64.92 64.59,65.15 64.36,65.15 64.14,65.38 64.14,65.61 63.22,66.52 63.22,68.12 63.45,68.35 63.45,77.5 64.36,78.41 | 64.36,78.41 64.59,78.64 JP5.49 64.36,78.41 | 64.36,78.41 64.36,79.1 64.14,79.32 64.14,79.55 63.22,80.47 63.22,82.07 63.45,82.3 63.45,91.44 64.59,92.58 JP6.49
N$16
  Bottom 0.254: JP1.47 62.31,22.86 63.45,24 63.45,24.46 63.22,24.69 63.22,26.29 63.45,26.52 63.45,35.66 62.31,36.8 JP2.47 62.08,37.03 61.85,37.03 60.94,37.95 60.94,38.41 60.71,38.63 60.71,40.23 61.16,40.69 61.16,49.61 62.31,50.75 JP3.47 62.08,50.98 60.94,52.12 60.94,52.35 60.71,52.58 60.71,54.18 60.94,54.41 60.94,63.55 61.85,64.47 | 61.85,64.47 62.08,64.69 JP4.47 61.85,64.47 | 61.85,64.47 61.85,65.15 61.62,65.38 61.62,65.61 60.71,66.52 60.71,68.12 60.94,68.35 60.94,77.5 62.08,78.64 JP5.47 62.08,78.87 60.94,80.01 60.94,80.24 60.71,80.47 60.71,82.07 60.94,82.3 60.94,91.44 62.08,92.58 JP6.47
N$17
  Bottom 0.254: JP6.45 58.42,91.44 58.42,82.3 58.19,82.07 58.19,80.47 58.42,80.24 58.42,80.01 JP5.45 59.56,78.64 58.42,77.5 58.42,68.35 58.19,68.12 58.19,66.52 58.42,66.29 58.42,66.06 59.56,64.92 JP4.45 59.56,64.69 59.56,64.24 59.33,64.01 59.33,63.78 58.88,63.32 58.88,54.86 58.19,54.18 58.19,53.95 58.42,53.72 58.42,52.12 59.56,50.98 JP3.45 59.56,50.75 58.42,49.61 58.42,40.46 58.19,40.23 58.19,38.63 58.42,38.41 58.42,37.95 59.33,37.03 59.56,37.03 JP2.45 59.79,36.8 59.79,36.35 60.94,35.2 60.94,26.52 60.71,26.29 60.71,24.69 60.94,24.46 60.94,24 59.79,22.86 JP1.45
N$18
  Bottom 0.254: JP6.43 57.05,92.58 55.91,91.44 55.91,82.3 56.13,82.07 56.13,80.47 55.91,80.24 55.91,80.01 57.05,78.87 JP5.43 55.91,77.5 55.91,68.35 56.13,68.12 56.13,66.52 55.91,66.29 55.91,66.06 57.05,64.92 JP4.43 57.05,64.69 55.91,63.55 55.91,54.41 56.13,54.18 56.13,52.58 55.91,52.35 55.91,52.12 57.05,50.98 JP3.43 57.05,50.75 55.91,49.61 55.91,40.46 56.13,40.23 56.13,38.63 55.91,38.41 55.91,37.95 56.82,37.03 57.05,37.03 JP2.43 57.05,36.8 57.05,36.35 56.13,35.43 56.13,26.75 55.68,26.29 55.68,24.69 55.91,24.46 55.91,24 57.05,22.86 JP1.43
N$19
  Bottom 0.254: JP6.41 54.53,92.58 54.53,92.13 54.3,91.9 54.3,91.67 53.39,90.75 53.39,82.3 53.62,82.07 53.62,80.47 53.39,80.24 53.39,80.01 54.53,78.87 JP5.41 54.53,78.64 53.39,77.5 53.39,68.35 53.62,68.12 53.62,66.52 53.39,66.29 53.39,66.06 54.53,64.92 JP4.41 53.39,63.55 53.39,54.41 53.62,54.18 53.62,52.58 53.39,52.35 53.39,52.12 54.53,50.98 JP3.41 54.53,50.75 53.39,49.61 53.39,40.46 53.62,40.23 53.62,38.63 53.39,38.41 53.39,38.18 54.53,37.03 JP2.41 54.53,36.8 53.39,35.66 53.39,26.52 53.62,26.29 53.62,24.69 53.39,24.46 53.39,24 54.53,22.86 JP1.41
N$20
  Bottom 0.254: 52.02,36.8 50.88,35.66 50.88,26.52 51.11,26.29 51.11,25.83 50.88,25.6 50.88,25.15 51.11,24.92 51.11,24.69 50.88,24.46 50.88,24 52.02,22.86 JP1.39 | 52.02,50.75 50.88,49.61 50.88,40.46 51.11,40.23 51.11,40.01 50.88,39.78 50.88,39.09 51.11,38.86 51.11,38.63 50.88,38.41 50.88,37.95 52.02,36.8 | 52.02,36.8 JP2.39 | 52.02,64.69 50.88,63.55 50.88,54.41 51.11,54.18 51.11,53.95 50.88,53.72 50.88,53.03 51.11,52.81 51.11,52.58 50.88,52.35 50.88,51.89 52.02,50.75 | 52.02,50.75 JP3.39 | 52.02,64.69 50.88,65.84 50.88,66.29 51.11,66.52 51.11,66.75 50.88,66.98 50.88,67.67 51.11,67.89 51.11,68.12 50.88,68.35 50.88,77.5 52.02,78.64 JP5.39 52.02,78.87 52.25,79.1 52.48,79.1 52.93,79.55 52.93,80.7 53.16,80.92 53.16,81.61 52.93,81.84 52.93,90.98 53.16,91.21 53.16,91.67 52.25,92.58 JP6.39 | 52.02,64.69 JP4.39
N$21
  Bottom 0.254: JP6.37 49.51,92.58 49.73,92.35 49.96,92.35 50.65,91.67 50.65,82.53 51.11,82.07 51.11,81.84 50.88,81.61 50.88,80.92 51.11,80.7 51.11,80.47 49.73,79.1 49.73,78.87 JP5.37 49.51,78.64 48.36,77.5 48.36,68.35 48.59,68.12 48.59,67.89 48.36,67.67 48.36,66.98 48.59,66.75 48.59,66.52 48.36,66.29 48.36,65.84 49.51,64.69 | 49.51,36.8 48.36,35.66 48.36,26.29 48.59,26.06 48.36,25.83 48.36,24 49.51,22.86 JP1.37 | 49.51,50.75 48.36,49.61 48.36,40.23 48.59,40.01 48.36,39.78 48.36,39.09 48.59,38.86 48.59,38.63 48.36,38.41 48.36,37.95 49.51,36.8 | 49.51,36.8 JP2.37 | 49.51,64.69 48.36,63.55 48.36,53.03 48.59,52.81 48.59,52.58 48.36,52.35 48.36,51.89 49.51,50.75 | 49.51,50.75 JP3.37 | 49.51,64.69 JP4.37
N$22
  Bottom 0.254: JP1.35 45.85,24 45.85,25.83 46.08,26.06 45.62,26.52 45.62,35.43 46.99,36.8 | 46.99,50.75 45.62,49.38 45.62,40.23 45.39,40.01 45.62,39.78 45.62,39.09 45.39,38.86 45.39,38.63 45.85,38.18 45.85,37.95 46.99,36.8 | 46.99,36.8 JP2.35 | 46.99,64.69 45.62,63.32 45.62,53.03 45.39,52.81 45.39,52.58 46.08,51.89 46.08,51.66 46.99,50.75 | 46.99,50.75 JP3.35 | 46.99,78.64 46.99,77.5 45.85,76.35 45.85,67.21 45.39,66.75 45.39,66.52 46.3,65.61 46.3,65.38 46.99,64.69 | 46.99,64.69 JP4.35 | 46.99,78.64 45.62,80.01 45.62,80.24 46.08,80.7 45.85,80.92 45.85,91.44 46.99,92.58 JP6.35 | 46.99,78.64 JP5.35
N$23
  Bottom 0.254: JP1.33 44.25,22.86 44.25,23.09 43.1,24.23 43.1,24.46 42.88,24.69 42.88,24.92 43.1,25.15 43.1,25.6 42.88,25.83 42.88,26.29 43.33,26.75 43.33,35.66 44.48,36.8 JP2.33 44.48,37.03 44.25,37.26 44.02,37.26 43.56,37.72 43.56,37.95 42.88,38.63 42.88,38.86 43.1,39.09 43.1,39.78 42.88,40.01 42.88,40.23 43.1,40.46 43.1,49.38 44.25,50.52 44.25,50.75 JP3.33 44.25,50.98 44.25,51.21 43.33,52.12 43.33,52.58 43.56,52.81 43.1,53.26 43.1,53.72 42.88,53.95 42.88,54.18 44.48,55.78 44.48,64.69 JP4.33 44.25,64.92 44.25,65.15 42.88,66.52 42.88,66.75 43.1,66.98 43.1,67.67 42.88,67.89 42.88,68.12 44.48,69.72 44.48,78.64 JP5.33 44.48,78.87 44.25,79.1 44.02,79.1 43.79,79.32 43.79,79.55 42.88,80.47 42.88,80.7 43.33,81.15 43.33,91.44 44.25,92.35 44.25,92.58 JP6.33
N$25
  Bottom 0.254: LED1.A 93.85,7.77 93.85,13.95 R1.1
N$26
  Bottom 0.254: 20.47,13.95 20.47,10.06 21.39,9.14 21.39,7.77 IC1.1 | 20.47,13.95 21.61,15.09 C2.+ | 20.47,13.95 18.41,13.95 17.27,15.09 16.59,15.09 D1.C
N$27
  Bottom 0.254: MAX811.3 42.65,12.12 42.65,10.97 43.79,9.83 47.22,9.83 47.9,9.14 49.28,9.14 S1.1 49.51,9.14 50.65,9.14 51.56,10.06 53.62,10.06 54.53,9.14 55.68,9.14 S1.2
VCC
  Bottom 0.254: JP6.27 36.93,92.58 38.08,91.44 38.08,82.3 37.85,82.07 37.85,80.47 38.08,80.24 38.08,80.01 36.93,78.87 JP5.27 38.08,77.5 38.08,68.35 37.85,68.12 37.85,66.52 38.08,66.29 38.08,66.06 36.93,64.92 JP4.27 36.93,64.69 38.08,63.55 38.08,54.41 37.85,54.18 37.85,52.58 38.08,52.35 38.08,52.12 36.93,50.98 JP3.27 36.93,50.75 38.08,49.61 38.08,40.46 37.85,40.23 37.85,38.63 38.08,38.41 38.08,37.95 37.16,37.03 36.93,37.03 JP2.27 36.93,36.8 36.93,36.35 38.08,35.2 38.08,26.29 38.3,26.06 38.3,24.69 38.08,24.46 38.08,24.23 36.7,22.86 JP1.27 36.93,22.86 36.93,22.4 40.59,18.75 40.59,14.17 40.82,13.95 | 40.82,13.95 42.19,13.95 | 42.19,13.95 42.42,13.95 MAX811.4 42.19,13.95 | 40.82,13.95 33.05,6.17 C1.1 32.82,6.4 31.45,7.77 26.87,7.77 IC1.3 | 42.19,13.95 42.19,14.63 43.1,15.54 45.62,15.54 45.85,15.32 92.94,15.32 93.85,16.23 93.85,16.46 R1.2

### Text on the board
tPlace: !RESET | !NMI | !M1 | !INT | !HALT | !BUSREQ | !BUSACK | !WAIT | CLK | !MREQ | !IOREQ | !WR | !RD | VCC | GND | A15 | A14 | A13 | A12 | A11 | A10 | A9 | A8 | A7 | A6 | A5 | A4 | A3 | A2 | A1 | A0 | GND | D7 | D6 | D5 | D4 | D3 | D2 | D1 | D0 | CPD-80 MUDDI v1 | 2017 jhbruhn